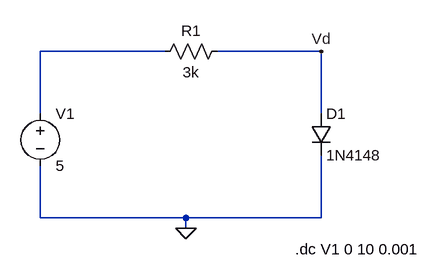
[diagram p0: schematic diodeIV.asc]
diodeIV.asc, the LTspice schematic file:
Version 4
SHEET 1 880 680
WIRE 112 80 -80 80
WIRE 352 80 192 80
WIRE -80 176 -80 80
WIRE 352 176 352 80
WIRE -80 336 -80 256
WIRE 144 336 -80 336
WIRE 352 336 352 240
WIRE 352 336 144 336
WIRE 144 352 144 336
FLAG 144 352 0
FLAG 352 80 Vd
SYMBOL diode 336 176 R0
SYMATTR InstName D1
SYMATTR Value 1N4148
SYMBOL voltage -80 160 R0
WINDOW 123 0 0 Left 0
WINDOW 39 0 0 Left 0
SYMATTR InstName V1
SYMATTR Value 5
SYMBOL res 96 96 R270
WINDOW 0 32 56 VTop 2
WINDOW 3 0 56 VBottom 2
SYMATTR InstName R1
SYMATTR Value 3k
TEXT 312 384 Left 2 !.dc V1 0 10 0.001

The netlist it stands for:
* diodeIV.asc
D1 Vd 0 1N4148
V1 N001 0 5
R1 N001 Vd 3k
.model D D
.lib standard.dio
.dc V1 0 10 0.001
.backanno
.end

* Results of the author's LTspice run, read from the files saved beside the schematic
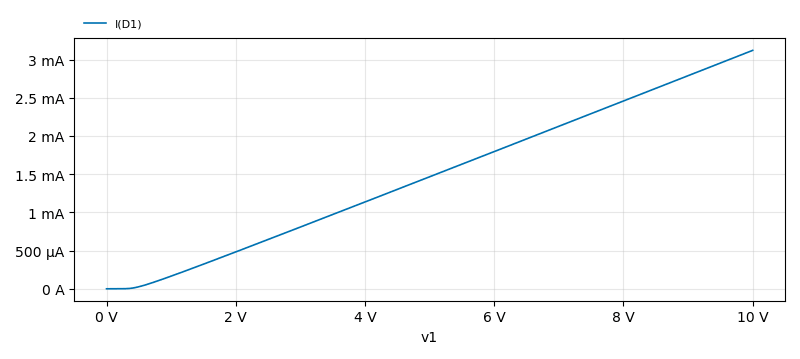
[diagram p1: DC transfer characteristic of diodeIV.asc, plotted from the saved traces]
* DC transfer characteristic, 1 run:
*   I(D1): 0 A at v1=0 V, 3.121 mA at v1=10 V, min 0 A, max 3.121 mA